# EAGLE design SANE v1 (EAGLE 7.3.0)
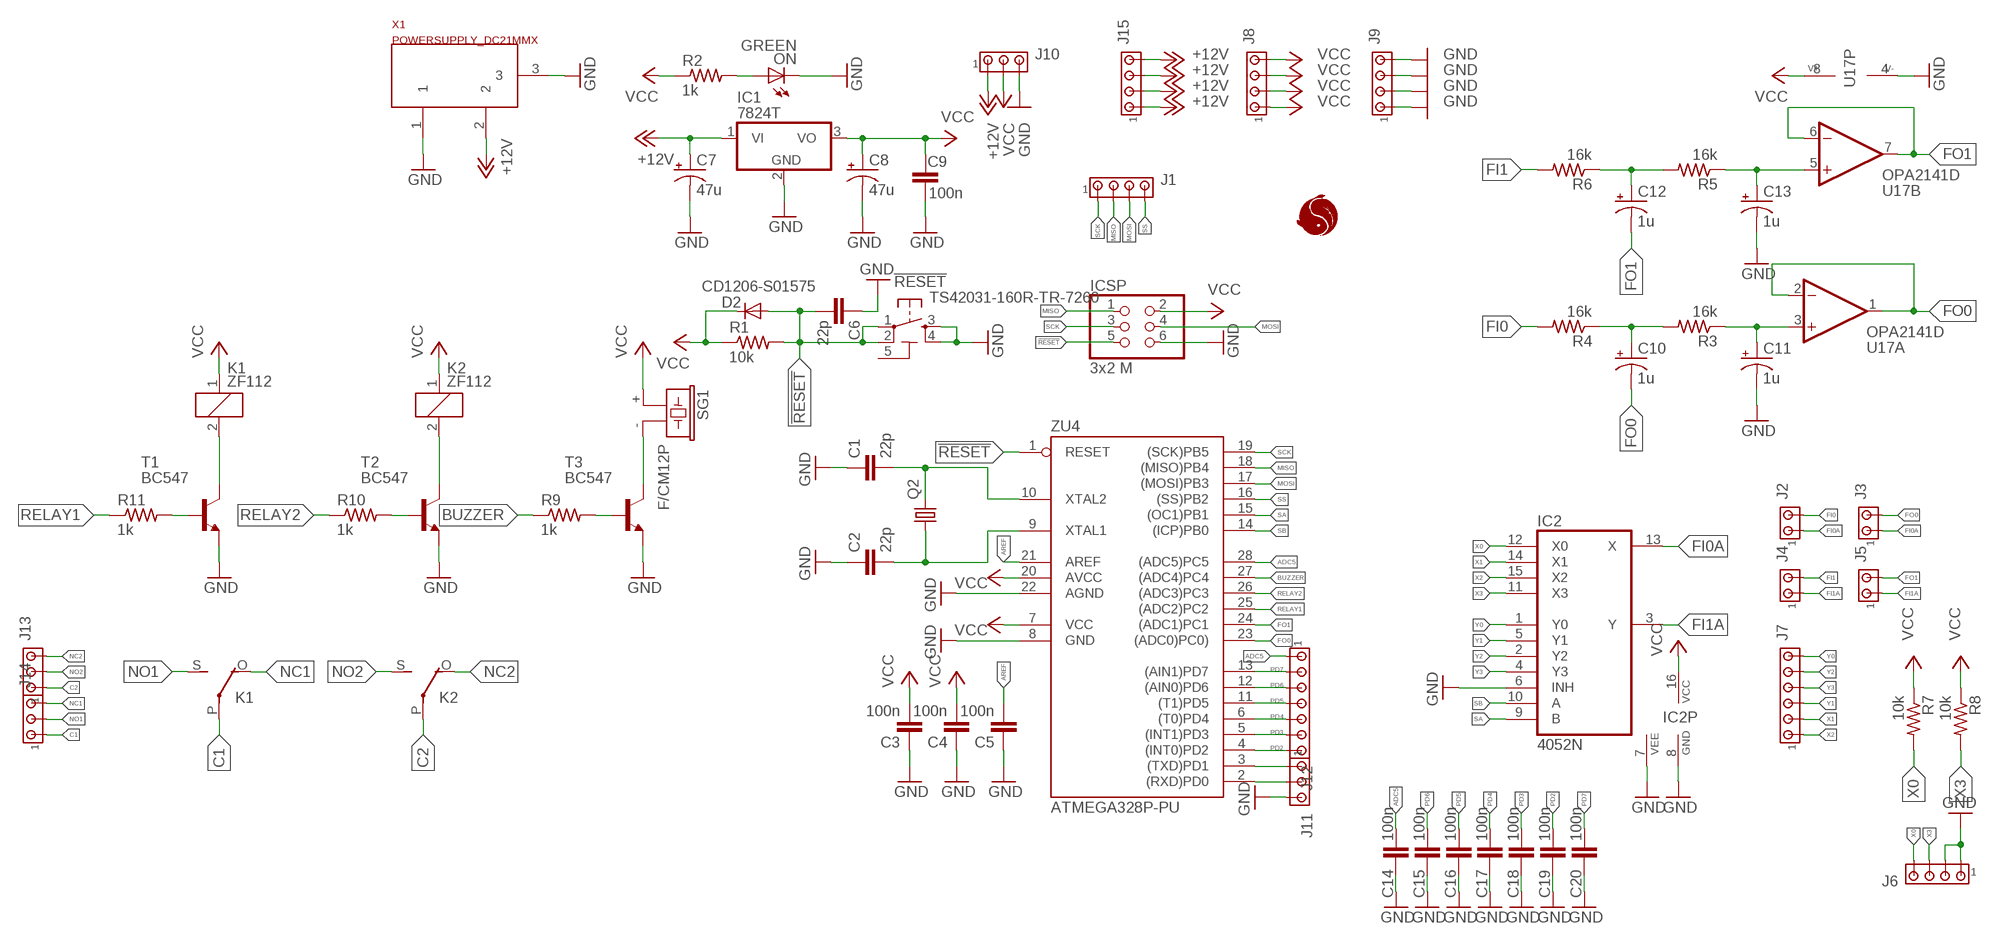
[diagram p0: schematic, sheet 1]

## Parts
!RESET  TS42031-160R-TR-7260  TS42  [TS42]
C1  22p  C-EUC0805  [C0805]
C2  22p  C-EUC0805  [C0805]
C3  100n  C-EUC0805  [C0805]
C4  100n  C-EUC0805  [C0805]
C5  100n  C-EUC0805  [C0805]
C6  22p  C-EUC0805  [C0805]
C7  47u  CPOL-USE2-4  [E2-4]
C8  47u  CPOL-USE2-4  [E2-4]
C9  100n  C-EUC0805  [C0805]
C10  1u  CPOL-USE2-4  [E2-4]
C11  1u  CPOL-USE2-4  [E2-4]
C12  1u  CPOL-USE2-4  [E2-4]
C13  1u  CPOL-USE2-4  [E2-4]
C14  100n  C-EUC0805  [C0805]
C15  100n  C-EUC0805  [C0805]
C16  100n  C-EUC0805  [C0805]
C17  100n  C-EUC0805  [C0805]
C18  100n  C-EUC0805  [C0805]
C19  100n  C-EUC0805  [C0805]
C20  100n  C-EUC0805  [C0805]
D2  CD1206-S01575  DIODE-MINIMELF  [MINIMELF]
IC1  7824T  [TO220H]
IC2  4052N  [DIL16]
ICSP  3x2 M  PINHD-2X3  [2X03]
J1  MTA04-100  [10X04MTA]
J2  MTA02-100  [10X02MTA]
J3  MTA02-100  [10X02MTA]
J4  MTA02-100  [10X02MTA]
J5  MTA02-100  [10X02MTA]
J6  MTA04-100  [10X04MTA]
J7  MTA06-100  [10X06MTA]
J8  MTA04-100  [10X04MTA]
J9  MTA04-100  [10X04MTA]
J10  MTA03-100  [10X03MTA]
J11  MTA03-100  [10X03MTA]
J12  MTA07-100  [10X07MTA]
J13  MTA03-156  [1X3MTA]
J14  MTA03-156  [1X3MTA]
J15  MTA04-100  [10X04MTA]
K1  ZF112  [ZF112]
K2  ZF112  [ZF112]
ON  GREEN  LEDCHIP-LED0805  [CHIP-LED0805]
Q2  CRYSTALHC49U-V  [HC49U-V]
R1  10k  R-US_R0805  [R0805]
R2  1k  R-US_R0805  [R0805]
R3  16k  R-US_R0805  [R0805]
R4  16k  R-US_R0805  [R0805]
R5  16k  R-US_R0805  [R0805]
R6  16k  R-US_R0805  [R0805]
R7  10k  R-US_R0805  [R0805]
R8  10k  R-US_R0805  [R0805]
R9  1k  R-US_R0805  [R0805]
R10  1k  R-US_R0805  [R0805]
R11  1k  R-US_R0805  [R0805]
SG1  F/CM12P  [F/CM12P]
T1  BC547  [TO92]
T2  BC547  [TO92]
T3  BC547  [TO92]
U17  OPA2141D  [SO08]
U$1  LOGO-SANE  [LOGO-SANE]
X1  POWERSUPPLY_DC21MMX  [POWERSUPPLY_DC-21MM]
ZU4  ATMEGA328P-PU  [DIL28-3]

## Nets
!RESET: !RESET.1 !RESET.2 C6.2 D2.A ICSP.5 R1.2 ZU4.1(RESET)
+12V: C7.+ IC1.1(VI) J10.1 J15.1 J15.2 J15.3 J15.4 X1.2
ADC5: C14.2 J12.1 ZU4.28((ADC5)PC5)
AREF: C5.2 ZU4.21(AREF)
BUZZER: R9.1 ZU4.27((ADC4)PC4)
C1: J14.1 K1.P(2:P)
C2: J13.1 K2.P(2:P)
FI0: J2.2 R4.2
FI0A: IC2.13(X) J2.1 J3.1
FI1: J4.2 R6.2
FI1A: IC2.3(Y) J4.1 J5.1
FO0: C10.- J3.2 U17.1(A:OUT) U17.2(A:-IN) ZU4.23((ADC0)PC0))
FO1: C12.- J5.2 U17.6(B:-IN) U17.7(B:OUT) ZU4.24((ADC1)PC1)
GND: !RESET.3 !RESET.4 C1.1 C2.1 C3.1 C4.1 C5.1 C6.1 C7.- C8.- C9.1 C11.- C13.- C14.1 C15.1 C16.1 C17.1 C18.1 C19.1 C20.1 IC1.2(GND) IC2.6(INH) IC2.7(VEE) IC2.8(GND) ICSP.6 J6.1 J6.2 J9.1 J9.2 J9.3 J9.4 J10.3 J11.3 ON.C T1.1(E) T2.1(E) T3.1(E) U17.4(P:V-) X1.1 X1.3 ZU4.8(GND) ZU4.22(AGND)
MISO: ICSP.1 J1.2 ZU4.18((MISO)PB4)
MOSI: ICSP.4 J1.3 ZU4.17((MOSI)PB3)
N$1: C1.2 Q2.2 ZU4.10(XTAL2)
N$2: C2.2 Q2.1 ZU4.9(XTAL1)
N$3: ON.A R2.2
N$4: C11.+ R3.1 U17.3(A:+IN)
N$5: C10.+ R3.2 R4.1
N$6: C12.+ R5.2 R6.1
N$7: C13.+ R5.1 U17.5(B:+IN)
N$8: J11.1 ZU4.3((TXD)PD1)
N$9: J11.2 ZU4.2((RXD)PD0)
N$10: SG1.- T3.3(C)
N$14: K1.2 T1.3(C)
N$15: K2.2 T2.3(C)
N$16: R11.2 T1.2(B)
N$17: R10.2 T2.2(B)
N$18: R9.2 T3.2(B)
NC1: J14.3 K1.O(2:O)
NC2: J13.3 K2.O(2:O)
NO1: J14.2 K1.S(2:S)
NO2: J13.2 K2.S(2:S)
PD2: C19.2 J12.7 ZU4.4((INT0)PD2)
PD3: C18.2 J12.6 ZU4.5((INT1)PD3)
PD4: C17.2 J12.5 ZU4.6((T0)PD4)
PD5: C16.2 J12.4 ZU4.11((T1)PD5)
PD6: C15.2 J12.3 ZU4.12((AIN0)PD6)
PD7: C20.2 J12.2 ZU4.13((AIN1)PD7)
RELAY1: R11.1 ZU4.25((ADC2)PC2)
RELAY2: R10.1 ZU4.26((ADC3)PC3)
SA: IC2.9(B) ZU4.15((OC1)PB1)
SB: IC2.10(A) ZU4.14((ICP)PB0)
SCK: ICSP.3 J1.1 ZU4.19((SCK)PB5)
SS: J1.4 ZU4.16((SS)PB2)
VCC: C3.2 C4.2 C8.+ C9.2 D2.C IC1.3(VO) IC2.16(VCC) ICSP.2 J8.1 J8.2 J8.3 J8.4 J10.2 K1.1 K2.1 R1.1 R2.1 R7.1 R8.1 SG1.+ U17.8(P:V+) ZU4.7(VCC) ZU4.20(AVCC)
X0: IC2.12(X0) J6.4 R7.2
X1: IC2.14(X1) J7.2
X2: IC2.15(X2) J7.1
X3: IC2.11(X3) J6.3 R8.2
Y0: IC2.1(Y0) J7.6
Y1: IC2.5(Y1) J7.3
Y2: IC2.2(Y2) J7.5
Y3: IC2.4(Y3) J7.4

## Power pins joined to a net without a drawn wire
5-GND: !RESET.5(5-GND)

## Library data of the parts
!RESET = SmartPrj:TS42: TS42 Dongnan Electronics Tact switch VDC 12V - 50mA
C1-C6 C9 C14-C20 = rcl:C-EU: CAPACITOR, European symbol
C7 C8 C10-C13 = rcl:CPOL-US: POLARIZED CAPACITOR, American symbol
D2 = diode:DIODE-: DIODE
IC1 = linear:78*: Positive VOLTAGE REGULATOR Source: http://cache.national.com/ds/LM/LM78L05.pdf http://www.fairchildsemi.com/ds/LM/LM7805.pdf
IC2 = 40xx:4052: Dual 4-channel ANALOG MULTIPLEXER
ICSP = SmartPrj:PINHD-2X3: PIN HEADER
J1 J6 J8 J9 J15 = con-amp:MTA04-100: AMP connector
J2-J5 = con-amp:MTA02-100: AMP connector
J7 = con-amp:MTA06-100: AMP connector Connection corrected 2014-09-19
J10 J11 = con-amp:MTA03-100: AMP connector
J12 = con-amp:MTA07-100: AMP connector
J13 J14 = con-amp:MTA03-156: AMP connector
K1 K2 = relay:ZF112: RELAY 1 x switch; OC_FARNELL: unknown; OC_NEWARK: unknown
ON = led:LED: LED OSRAM: - CHIPLED LG R971, LG N971, LY N971, LG Q971, LY Q971, LO R971, LY R971 LH N974, LH R974 LS Q976, LO Q976, LY Q976 LO Q996 - Hyper CHIPLED LW Q18S LB Q993, LB Q99A, LB R99A - SideLED LS A670, LO A670, LY A670, LG A670, LP A670 LB A673, LV A673, LT A673, LW A673 LH A674 LY A675 LS A676, LA A676, LO A676, LY A676, LW A676 LS A679, LY A679, LG A679 - Hyper Micro SIDELED® LS Y876, LA Y876, LO Y876, LY Y876 LT Y87S - SmartLED LW L88C, LW L88S LB L89C, LB L89S, LG L890 LS L89K, LO L89K, LY L89K LS L896, LA L896, LO L896, LY L896 - TOPLED LS T670, LO T670, LY T670, LG T670, LP T670 LSG T670, LSP T670, LSY T670, LOP T670, LYG T670 LG T671, LOG T671, LSG T671 LB T673, LV T673, LT T673, LW T673 LH T674 LS T676, LA T676, LO T676, LY T676, LB T676, LH T676, LSB T676, LW T676 LB T67C, LV T67C, LT T67C, LS T67K, LO T67K, LY T67K, LW E67C LS E67B, LA E67B, LO E67B, LY E67B, LB E67C, LV E67C, LT E67C LW T67C LS T679, LY T679, LG T679 LS T770, LO T770, LY T770, LG T770, LP T770 LB T773, LV T773, LT T773, LW T773 LH T774 LS E675, LA E675, LY E675, LS T675 LS T776, LA T776, LO T776, LY T776, LB T776 LHGB T686 LT T68C, LB T68C - Hyper Mini TOPLED® LB M676 - Mini TOPLED Santana® LG M470 LS M47K, LO M47K, LY M47K Source: http://www.osram.convergy.de LUXEON: - LUMILED® LXK2-PW12-R00, LXK2-PW12-S00, LXK2-PW14-U00, LXK2-PW14-V00 LXK2-PM12-R00, LXK2-PM12-S00, LXK2-PM14-U00 LXK2-PE12-Q00, LXK2-PE12-R00, LXK2-PE12-S00, LXK2-PE14-T00, LXK2-PE14-U00 LXK2-PB12-K00, LXK2-PB12-L00, LXK2-PB12-M00, LXK2-PB14-N00, LXK2-PB14-P00, LXK2-PB14-Q00 LXK2-PR12-L00, LXK2-PR12-M00, LXK2-PR14-Q00, LXK2-PR14-R00 LXK2-PD12-Q00, LXK2-PD12-R00, LXK2-PD12-S00 LXK2-PH12-R00, LXK2-PH12-S00 LXK2-PL12-P00, LXK2-PL12-Q00, LXK2-PL12-R00 Source: www.luxeon.com KINGBRIGHT: KA-3528ASYC Source: www.kingbright.com
Q2 = crystal:CRYSTAL: CRYSTAL; OC_FARNELL: 1666969; OC_NEWARK: unknown
R1-R11 = resistor:R-US_: RESISTOR, American symbol
SG1 = buzzer:F/CM12P: BUZZER Source: Buerklin; OC_FARNELL: unknown; OC_NEWARK: unknown
T1-T3 = transistor:BC547: NPN TRANSISTOR
U17 = amp-op:OPA2141: OP-AMP Single-Supply, 10MHz, Rail-to-Rail Output, Low-Noise, JFET Amplifier
U$1 = logo-sane:LOGO-SANE
X1 = SmartPrj:POWERSUPPLY_DC21MM
ZU4 = SmartPrj:ATMEGA328P-: MICROCONTROLLER 4 Kbytes FLASH 128 bytes SRAM 256 bytes EEPROM UART 6-channel 10 bit ADC

## Net classes
0 default: width 0.203 mm, drill 0.406 mm, clearance 0.203 mm
1 power: width 0.61 mm, drill 0.61 mm, clearance 0.254 mm
2 gnd: width 0.305 mm, drill 0.559 mm, clearance 0.254 mm
3 usbvcc: width 0.508 mm, drill 0.61 mm, clearance 0.254 mm

## Board
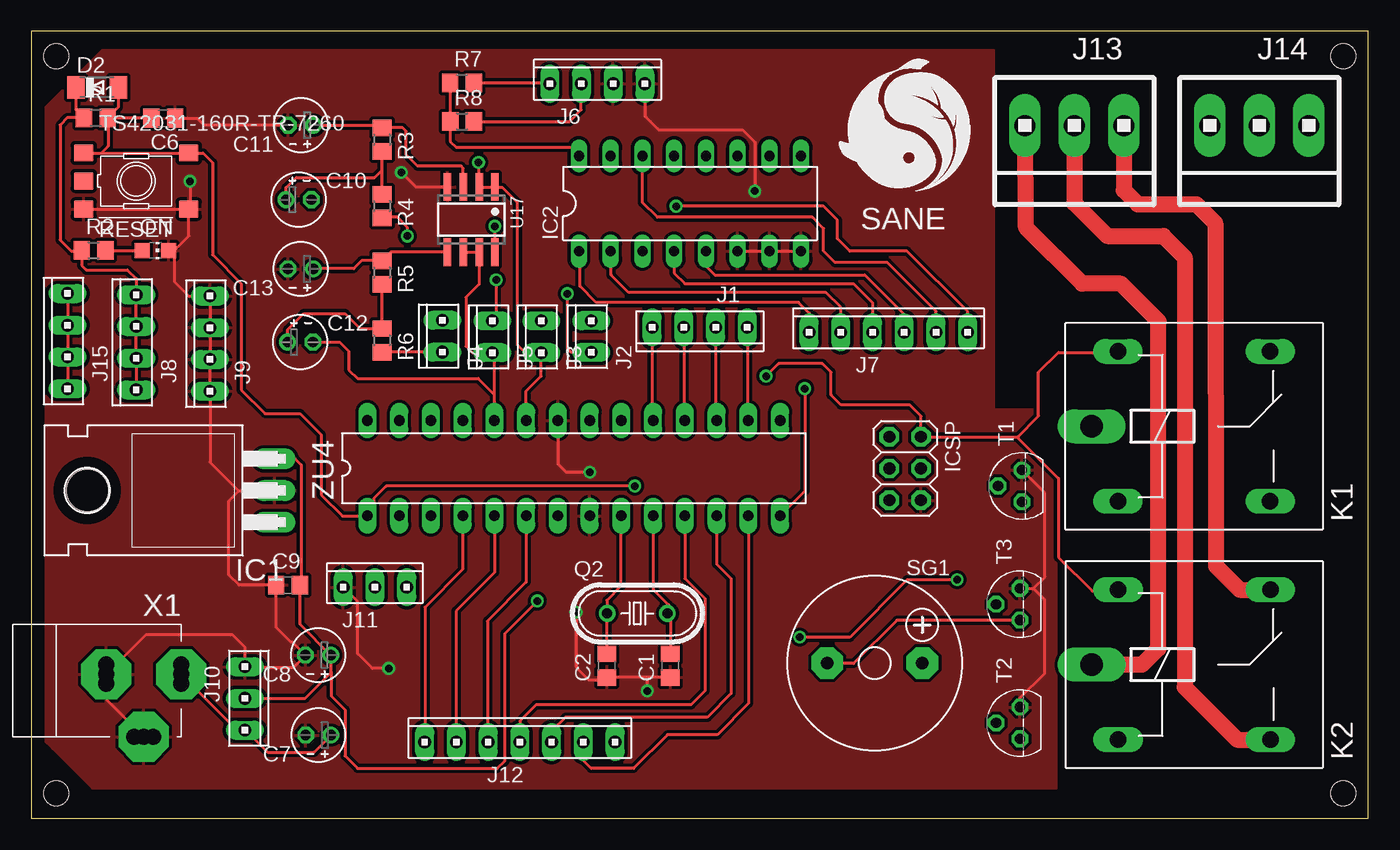
[diagram p1: board, top side]
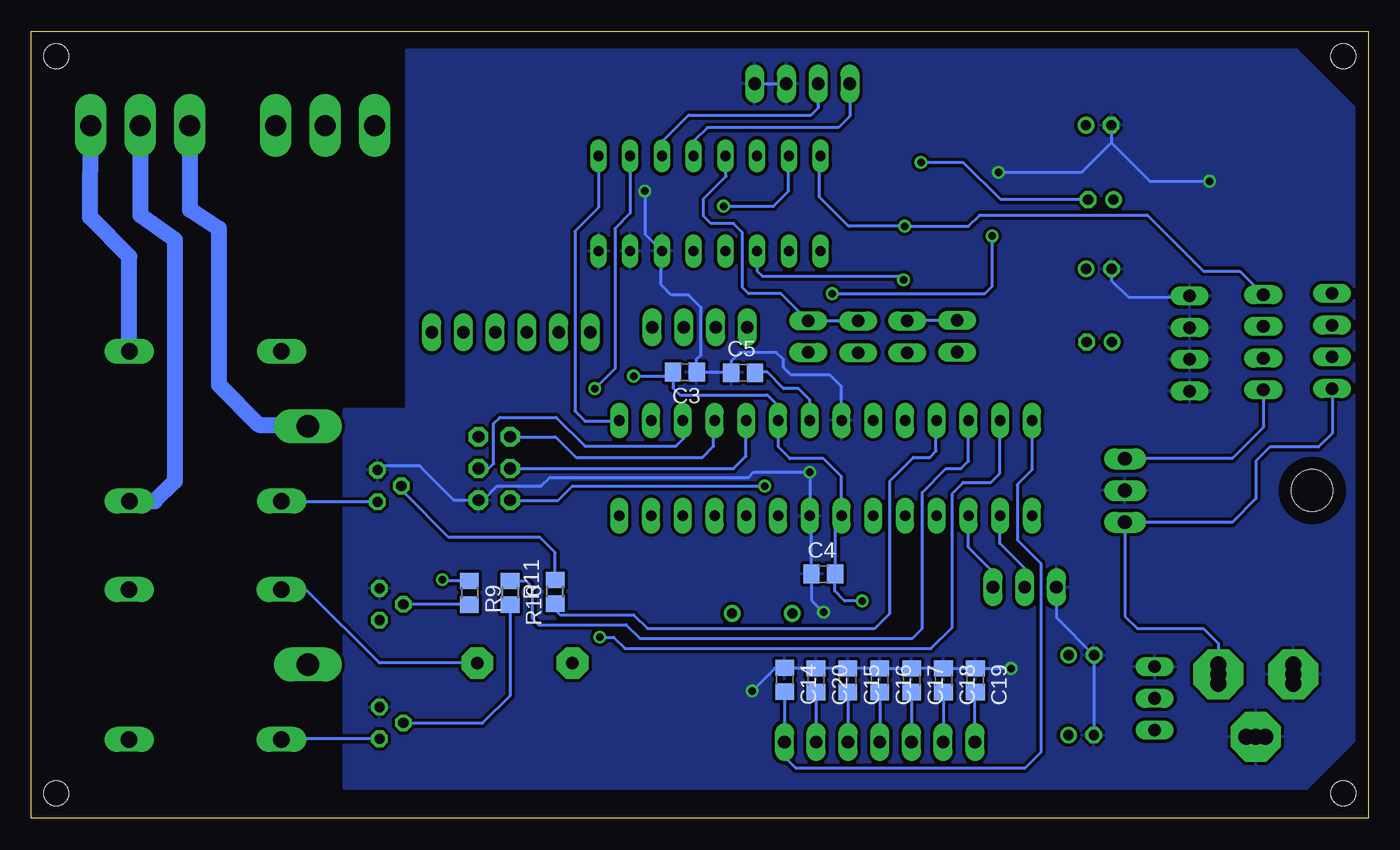
[diagram p2: board, bottom side, seen from below]

Size 107 x 63 mm. Coordinates in mm from the lower left corner, seen from the top.
Outline: 0,0 107,0 107,63 0,63 0,0
Copper layers (1*16): Top 0.035mm / dielectric 1.5mm / Bottom 0.035mm
Design rules "default *": minimum track width 10mil, minimum drill 24mil, track to track 10mil, track to pad 10mil, pad to pad 10mil, via to via 10mil, smd to smd 10mil, copper to edge 40mil, drill to drill 8mil, minimum pad ring 10mil, minimum via ring 8mil, stop-mask expansion 4mil, vias tented up to drill 0mil, thermal gap 10mil
Holes 2 mm at 105,2 105,61 2,61 2,2

### Footprints (pad centres in the part's own frame; a part is rotated, then mirrored left to right if it is on the bottom)
TS42 = smd 1.6 x 1.4: 1 -4.2,2.25; 2 4.2,2.25; 3 -4.2,-2.25; 4 4.2,-2.25; 5 -4.2,0
C0805 = smd 1.3 x 1.5: 1 -0.95,0; 2 0.95,0
E2-4 = drill 0.813 pad 1.27: + -1.016,0 | drill 0.813 pad 1.27 octagon: - 1.016,0
MINIMELF = smd 1.4 x 1.8: A 1.7,0; C -1.7,0
TO220H = drill 1.118 long: 1 -2.54,-10.16; 2 0,-10.16; 3 2.54,-10.16 | hole 3.302: 0,4.826
DIL16 = drill 0.813 long: 1 -8.89,-3.81; 2 -6.35,-3.81; 3 -3.81,-3.81; 4 -1.27,-3.81; 5 1.27,-3.81; 6 3.81,-3.81; 7 6.35,-3.81; 8 8.89,-3.81; 9 8.89,3.81; 10 6.35,3.81; 11 3.81,3.81; 12 1.27,3.81; 13 -1.27,3.81; 14 -3.81,3.81; 15 -6.35,3.81; 16 -8.89,3.81
2X03 = drill 0.95 pad 1.55 octagon: 1 -2.54,-1.27; 2 -2.54,1.27; 3 0,-1.27; 4 0,1.27; 5 2.54,-1.27; 6 2.54,1.27
10X04MTA = drill 1.016 long: 1 3.81,0; 2 1.27,0; 3 -1.27,0; 4 -3.81,0
10X02MTA = drill 1.016 long: 1 1.27,0; 2 -1.27,0
10X06MTA = drill 1.016 long: 1 6.35,0; 2 3.81,0; 3 1.27,0; 4 -1.27,0; 5 -3.81,0; 6 -6.35,0
10X03MTA = drill 1.016 long: 1 2.54,0; 2 0,0; 3 -2.54,0
10X07MTA = drill 1.016 long: 1 7.62,0; 2 5.08,0; 3 2.54,0; 4 0,0; 5 -2.54,0; 6 -5.08,0; 7 -7.62,0
1X3MTA = drill 1.676 long: 1 3.937,0; 2 -0.025,0; 3 -3.988,0
ZF112 = drill 1.321 long: 1 -6.096,5.994; 2 -6.096,-5.994; O 6.096,5.994; S 6.096,-5.994 | drill 1.803 long: P -8.204,0
CHIP-LED0805 = smd 1.2 x 1.2: A 0,-1.05; C 0,1.05
HC49U-V = drill 0.813: 1 -2.413,0; 2 2.413,0
R0805 = smd 1.3 x 1.5: 1 -0.95,0; 2 0.95,0
F/CM12P = drill 1.016 pad 2.54 octagon: + 3.81,0; - -3.81,0
TO92 = drill 0.813 octagon: 1 1.27,0; 2 0,1.905; 3 -1.27,0
SO08 = smd 0.6 x 2.2: 1 -1.905,-2.6; 2 -0.635,-2.6; 3 0.635,-2.6; 4 1.905,-2.6; 5 1.905,2.6; 6 0.635,2.6; 7 -0.635,2.6; 8 -1.905,2.6
POWERSUPPLY_DC-21MM = drill 1.3 pad 4 octagon: 1 -5.08,-3.353; 2 -0.076,-6.35; 3 -0.076,-0.356 | drill 1.3: 4 -5.08,-4.115; 5 -5.08,-2.591; 6 -0.838,-0.356; 7 0.686,-0.356; 8 -0.838,-6.35; 9 0.686,-6.35
DIL28-3 = drill 0.85 pad 1.422 long: 1 -16.51,-3.81; 2 -13.97,-3.81; 3 -11.43,-3.81; 4 -8.89,-3.81; 5 -6.35,-3.81; 6 -3.81,-3.81; 7 -1.27,-3.81; 8 1.27,-3.81; 9 3.81,-3.81; 10 6.35,-3.81; 11 8.89,-3.81; 12 11.43,-3.81; 13 13.97,-3.81; 14 16.51,-3.81; 15 16.51,3.81; 16 13.97,3.81; 17 11.43,3.81; 18 8.89,3.81; 19 6.35,3.81; 20 3.81,3.81; 21 1.27,3.81; 22 -1.27,3.81; 23 -3.81,3.81; 24 -6.35,3.81; 25 -8.89,3.81; 26 -11.43,3.81; 27 -13.97,3.81; 28 -16.51,3.81

### Placement (x,y rotation side)
!RESET  8.4,51.01 0 top
C1  51.14,12.22 90 top
C2  46.06,12.22 90 top
C3  54.7,35.72 180 bottom
C4  43.6,19.56 0 bottom
C5  50.03,35.67 0 bottom
C6  10.56,56.03 180 top
C7  22.98,6.66 180 top
C8  22.96,13.06 180 top
C9  20.54,18.67 0 top
C10  21.41,49.52 0 top
C11  21.58,55.48 180 top
C12  21.53,38.12 0 top
C13  21.56,43.98 180 top
C14  46.71,11.09 270 bottom
C15  41.65,11.06 270 bottom
C16  39.1,11.06 270 bottom
C17  36.55,11.06 270 bottom
C18  34,11.06 270 bottom
C19  31.45,11.06 270 bottom
C20  44.2,11.06 270 bottom
D2  5.26,58.51 0 top
IC1  9.31,26.24 90 top
IC2  52.72,49.21 0 top
ICSP  69.94,28 270 top
J1  53.5,39.3 180 top
J2  44.81,38.56 90 top
J3  40.81,38.54 90 top
J4  32.91,38.59 90 top
J5  36.91,38.54 90 top
J6  45.3,58.8 0 top
J7  68.6,38.9 0 top
J8  8.4,38.1 90 top
J9  14.3,38 90 top
J10  17.1,9.6 270 top
J11  27.5,18.5 0 top
J12  39.1,6.1 0 top
J13  83.45,55.45 180 top
J14  98.25,55.45 180 top
J15  2.9,38.2 90 top
K1  93.06,31.38 0 top
K2  93.07,12.31 0 top
ON  9.94,45.45 270 top
Q2  48.5,16.4 0 top
R1  5.16,56.07 0 top
R2  4.99,45.46 0 top
R3  28.07,54.32 270 top
R4  28.07,49 270 top
R5  28.07,43.68 270 top
R6  28.07,38.26 270 top
R7  34.46,58.87 0 top
R8  34.48,55.77 0 top
R9  71.93,18.06 270 bottom
R10  68.68,18.06 270 bottom
R11  65.07,18.14 90 bottom
SG1  67.5,12.43 0 top
T1  79.29,26.6 90 top
T2  79.13,7.63 90 top
T3  79.13,17.13 90 top
U17  35.21,47.92 180 top
U$1  65.2,49.9 0 top
X1  5.65,11.61 90 top
ZU4  43.42,28.03 0 top

### Tracks (layer width: path | path; a pad name or v marks a point on that pad's centre or on a via)
!RESET  (via drill 0.6)
  Top 0.254: !RESET.1 5.6,53.26 | 5.6,53.26 !RESET.2 13.74,53.26 14.5,52.5 14.5,45.1 16.8,42.8 16.8,34.3 18.7,32.4 21.5,32.4 23.2,30.7 23.2,25.9 24.9,24.2 26.89,24.2 ZU4.1 27.4,24.71 27.4,25.6 28.4,26.6 v48.3,26.6 | C6.2 6.15,56.03 | 6.15,56.03 R1.2 6.96,56.92 D2.A | 6.15,56.03 6.15,53.81 5.6,53.26
  Bottom 0.254: ICSP.5 64.84,25.46 63.7,26.6 v48.3,26.6
+12V
  Top 0.254: X1.2 16.47,7.06 J10.1 17.5,6.66 17.54,6.66 18.9,5.3 22.64,5.3 C7.+ | J15.1 J15.2 J15.3 J15.4
  Bottom 0.254: X1.2 12,14 13.2,15.2 18.5,15.2 19.47,16.17 IC1.1 10.9,23.7 9,25.6 9,28.6 7.9,29.7 4,29.7 2.9,30.8 J15.4
ADC5
  Bottom 0.254: C14.2 J12.1 46.7,6.08 46.7,4.9 45.8,4 27.5,4 26.2,5.3 26.2,20.4 28.1,22.3 28.1,26.7 26.91,27.89 ZU4.28
AREF
  Bottom 0.254: ZU4.21 44.69,33.49 45.6,34.4 46.8,34.4 48.1,35.7 49.05,35.7 C5.2
BUZZER  (via drill 0.6)
  Top 0.254: v74.1,19.1 70.1,19.1 65.5,14.5 v61.5,14.5
  Bottom 0.254: R9.1 74.01,19.01 v74.1,19.1 | v61.5,14.5 60.4,14.5 59.5,13.6 35,13.6 33.3,15.3 33.3,26 32.4,26.9 30.2,26.9 29.5,27.6 29.5,31.79 ZU4.27
C1
  Bottom 1.27: J14.1 94.31,48.71 92,47.2 92,34.7 88.8,31.5 84.98,31.5 K1.P
C2
  Top 1.27: K2.P 88.91,12.31 90.2,13.6 90.2,39.8 87.2,42.8 84.1,42.8 79.6,47.3 79.55,55.41 J13.1
FI0  (via drill 0.6)
  Top 0.254: J2.2 43.21,37.29 42.9,37.6 v42.9,42 | v30.1,46.6 30.1,47.3 29.3,48.1 28.12,48.1 R4.2
  Bottom 0.254: v42.9,42 30.7,42 30.1,42.6 v30.1,46.6
FI0A
  Bottom 0.254: J3.1 44.79,39.81 J2.1 44.83,39.83 47,42 49.6,42 50.1,42.5 50.1,46.9 50.8,47.6 52.6,47.6 53.2,48.2 53.2,49.6 51.4,51.4 51.4,52.97 IC2.13
FI1
  Top 0.254: J4.2 R6.2
FI1A  (via drill 0.6)
  Top 0.254: v37.2,43.1 37.2,40.1 J5.1
  Bottom 0.254: J4.1 36.86,39.86 J5.1 | IC2.3 48.91,43.81 48.5,43.4 37.5,43.4 v37.2,43.1
FO0  (via drill 0.6)
  Top 0.254: ZU4.23 39.61,34.21 40.8,35.4 J3.2 39.53,37.27 38.9,37.9 38.9,49.3 37.7,50.5 37.13,50.5 U17.1 U17.2 35.8,50.56 v35.8,52.5
  Bottom 0.254: C10.- 29.42,49.52 32.4,52.5 v35.8,52.5
FO1
  Top 0.254: ZU4.24 37.07,33.9 | 37.07,33.9 37.07,37.11 J5.2 36.88,37.3 35.3,37.3 34.8,37.8 34.8,41.7 35.84,42.74 U17.7 U17.6 | C12.- 24.68,38.12 25.4,37.4 25.4,35.9 26.1,35.2 35.77,35.2 37.07,33.9
GND  (via drill 0.6)
  Top 0.254: X1.1 6.01,9.53 X1.3 9.17,14.7 16.1,14.7 17.1,13.7 J10.3 17.1,12.1 20.98,12.1 C8.- 20.9,14.1 20.8,14.1 19.6,15.3 C9.1 16.63,18.67 15.8,19.5 15.8,25.4 16.6,26.2 | 16.6,26.2 19.43,26.2 IC1.2 | 16.6,26.2 14.3,28.5 J9.4 J9.3 J9.2 J9.1 12.6,41.8 11.45,42.95 11.45,45.45 | C1.1 49.3,11.27 | 49.3,11.27 C2.1 45.89,11.1 44.6,11.1 43.6,12.1 v43.6,16.5 | ON.C 11.45,45.45 | 11.45,45.45 12.6,46.6 !RESET.4 | !RESET.3 !RESET.4 | C11.- 13.82,55.48 13.3,56 11.54,56 C6.1 | IC2.6 IC2.7 IC2.8 | T2.1 79.13,9.63 81.1,11.6 81.1,17.5 80.2,18.4 | T3.1 80.2,18.4 | 80.2,18.4 81.1,19.3 81.1,26.06 T1.1 | v12.7,51 12.7,48.86 !RESET.4 | U17.4 30.78,50.52 v29.6,51.7 | J6.1 49.11,56.19 50.2,55.1 56.9,55.1 57.9,54.1 v57.9,50.2 | v49.3,10.2 49.3,11.27 | v28.6,12 27.3,12 26.1,13.2 26.1,17.36 J11.3 | ZU4.22 42.15,28.35 42.8,27.7 v44.7,27.7
  Bottom 0.254: C7.- 21.94,6.68 C8.- 24.96,16.08 J11.3 | 46.68,12.01 C20.1 C15.1 C16.1 C17.1 C18.1 C19.1 v28.61,12.01 v28.6,12 | 46.68,12.01 C14.1 | C13.- 20.54,43.04 19.2,41.7 14.41,41.7 J9.1 | J6.1 J6.2 | T1.1 78.96,28.2 75.9,28.2 73.16,25.46 ICSP.6 70.84,25.46 69.7,26.6 66.2,26.6 65.5,27.3 49.6,27.3 49.2,27.7 v44.7,27.7 ZU4.8 44.55,24.08 C4.1 44.55,17.45 v43.6,16.5 | C11.- 20.56,54.06 | 20.56,54.06 17.5,51 v12.7,51 | v29.6,51.7 22.93,51.7 20.56,54.06 | ZU4.22 42.15,34.55 43.1,35.5 46.2,35.5 46.8,36.1 46.8,36.7 47.4,37.3 50.3,37.3 50.98,36.62 C5.1 53.7,35.67 C3.1 53.75,36.75 53.4,37.1 53.4,40.9 54.4,41.9 55.8,41.9 56.6,42.7 56.6,45.33 IC2.6 57.9,46.77 v57.9,50.2 | 46.68,12.01 47.49,12.01 v49.3,10.2
  pour Bottom: 0.6,56.4 5.7,61.5 77,61.5 77,32.7 82,32.7 82,2.4 4.9,2.4 0.7,6.6 0.7,56.3
  pour Top: 0.6,56.5 0.7,56.5 5.7,61.5 77,61.5 77,32.7 82,32.7 82,2.4 4.9,2.4 1.7,5.6 1,6.3 0.7,6.6 0.7,56.4
MISO
  Top 0.254: J1.2 52.23,31.92 ZU4.18
  Bottom 0.254: ICSP.1 65.04,30.54 63.4,28.9 53.3,28.9 52.4,29.8 52.4,31.75 ZU4.18
MOSI
  Top 0.254: J1.3 54.77,31.92 ZU4.17
  Bottom 0.254: ICSP.4 70.4,28 70,28.4 70,31.6 69.5,32.1 65,32.1 62.7,29.8 55.4,29.8 54.8,30.4 54.8,31.79 ZU4.17
N$1
  Top 0.254: ZU4.10 49.8,24.19 49.8,18.3 51,17.1 50.91,17.1 Q2.2 51.14,16.4 C1.2 50.91,13.4
N$2
  Top 0.254: ZU4.9 47.2,24.19 47.2,18.6 46.06,17.46 46.09,17.46 Q2.1 46.09,13.2 C2.2
N$3
  Top 0.254: R2.2 ON.A
N$4
  Top 0.254: C11.+ 27.86,55.48 R3.1 28.1,55.3 29.7,55.3 30,55 30,53.1 30.9,52.2 34.4,52.2 34.58,52.02 U17.3
N$5
  Top 0.254: R4.1 28.07,51.9 | 28.07,51.9 R3.2 | C10.+ 20.39,50.49 21.2,51.3 27.47,51.3 28.07,51.9
N$6
  Top 0.254: R5.2 R6.1 26.3,39.2 25.1,40.4 21.8,40.4 20.51,39.11 C12.+
N$7
  Top 0.254: U17.5 28.76,45.32 R5.1 26.43,44.63 25.8,44 22.6,44 C13.+
N$8
  Bottom 0.254: J11.1 30.04,19.74 32,21.7 ZU4.3
N$9
  Bottom 0.254: J11.2 27.5,20 29.5,22 29.5,24.17 ZU4.2
N$10
  Top 0.254: T3.3 69.26,15.86 65.8,12.4 63.72,12.4 SG1.-
N$14
  Bottom 0.254: T1.3 86.91,25.33 K1.2
N$15
  Bottom 0.254: T2.3 86.93,6.36 K2.2
N$16
  Bottom 0.254: R11.2 65.07,21.27 66.3,22.5 73.6,22.5 77.1,26 77.1,26.32 T1.2
N$17
  Bottom 0.254: R10.2 68.68,9.82 70.9,7.6 77.19,7.6 T2.2
N$18
  Bottom 0.254: R9.2 77.2,17.11 T3.2
NC1
  Bottom 1.27: K1.O 99.16,44.96 102.3,48.1 102.25,55.44 J14.3
NC2
  Top 1.27: J13.3 87.44,50.26 88.55,49.15 93.25,49.15 94.75,47.65 94.8,20.2 96.7,18.3 K2.O
NO1
  Bottom 1.27: K1.S 97.11,25.39 95.5,27 95.5,46.3 98.25,48.25 98.25,55.42 J14.2
NO2
  Top 1.27: J13.2 83.47,49.23 86.1,46.6 90.6,46.6 92.3,44.9 92.3,10.5 96.5,6.3 99.15,6.3 K2.S
PD2
  Top 0.254: ZU4.4 34.53,19.93 31.5,16.9 31.5,6.12 J12.7
  Bottom 0.254: J12.7 31.48,10.08 C19.2
PD3
  Top 0.254: ZU4.5 37.07,19.67 34,16.6 34,6.12 J12.6
  Bottom 0.254: C18.2 34,6.12 J12.6
PD4
  Top 0.254: ZU4.6 39.61,18.91 36.5,15.8 36.5,6.16 J12.5
  Bottom 0.254: C17.2 J12.5
PD5
  Top 0.254: ZU4.11 52.31,19.19 53.9,17.6 53.9,10.2 52.8,9.1 40.4,9.1 39.1,7.8 J12.4
  Bottom 0.254: C16.2 J12.4
PD6
  Top 0.254: ZU4.12 54.85,20.35 56,19.2 56,10 54.1,8.1 42.75,8.1 41.65,7 J12.3
  Bottom 0.254: C15.2 J12.3
PD7
  Top 0.254: ZU4.13 57.39,9.19 54.9,6.7 50.9,6.7 48.2,4 44.8,4 44.2,4.6 44.2,6.08 J12.2
  Bottom 0.254: C20.2 44.2,6.12 J12.2
RELAY1
  Bottom 0.254: R11.1 65.07,16.67 64.7,16.3 58.8,16.3 57.7,15.2 39.5,15.2 38.3,16.4 38.3,27 36.4,28.9 35.1,28.9 34.6,29.4 34.6,31.77 ZU4.25
RELAY2
  Bottom 0.254: R10.1 67.41,19.01 66.9,18.5 66.9,16 66.4,15.5 59.4,15.5 58.3,14.4 36.5,14.4 35.7,15.2 35.7,26.1 33.8,28 32.6,28 32,28.6 ZU4.26
SA
  Bottom 0.254: IC2.9 61.61,48.89 63.5,47 63.5,32.6 62.7,31.8 59.97,31.8 ZU4.15
SB  (via drill 0.6)
  Top 0.254: v61.9,34.4 61.9,26.19 ZU4.14
  Bottom 0.254: IC2.10 59.07,48.43 60.3,47.2 60.3,36 v61.9,34.4
SCK
  Top 0.254: J1.1 49.69,31.92 ZU4.19
  Bottom 0.254: ICSP.3 50.8,28 49.8,29 49.8,31.81 ZU4.19
SS
  Top 0.254: J1.4 57.31,31.92 ZU4.16
VCC  (via drill 0.6)
  Top 0.254: J10.2 21.9,9.6 24,11.7 | 24,11.7 24,13.04 C8.+ 21.49,15.55 C9.2 21.6,18.78 21.6,28.3 21.12,28.78 IC1.3 | J8.4 J8.3 J8.2 J8.1 8.4,43.2 7.7,43.9 4.4,43.9 4.04,44.26 R2.1 3.98,45.4 3.2,45.4 2.3,46.3 2.3,55.5 2.87,56.07 R1.1 3.56,56.72 D2.C | R7.1 33.51,55.79 R8.1 33.53,54.17 34,53.7 43.15,53.7 IC2.16 | U17.8 37.12,47.38 v37.1,47.4 | 24,11.7 24,9.8 25.1,8.7 25.1,5 26.1,4 37.3,4 37.9,4.6 37.9,14.8 v40.5,17.4 | 78.94,30.54 ICSP.2 71.21,32.19 70.3,33.1 64.8,33.1 64,33.9 64,35.7 63.3,36.4 59.8,36.4 v58.8,35.4 | 78.94,30.54 80.6,32.2 80.6,35.7 82.2,37.3 86.89,37.3 K1.1 | 78.94,30.54 78.94,30.46 82.2,27.2 82.2,20.9 84.9,18.2 86.87,18.2 K2.1
  Bottom 0.254: J8.4 8.4,31.3 10.9,28.8 19.45,28.8 IC1.3 | 47.3,31.77 ZU4.20 | SG1.+ 79.13,12.43 84.9,18.2 86.87,18.2 K2.1 | IC2.16 43.9,52.95 43.9,49.7 41.6,47.4 v37.1,47.4 32,47.4 31.1,48.3 17.7,48.3 13.2,43.8 10.29,43.8 J8.1 | ZU4.20 47.2,31.87 47.2,33 48.1,33.9 55.1,33.9 55.65,34.45 C3.2 55.97,35.4 v58.8,35.4 | ZU4.20 47.2,31.81 47.2,29.7 46.3,28.8 43.6,28.8 42.15,27.35 ZU4.7 42.65,23.72 C4.2 42.7,19.51 42.7,18.2 41.9,17.4 v40.5,17.4
X0
  Top 0.254: R7.2 41.42,58.87 J6.4
  Bottom 0.254: J6.4 41.49,56.21 42.4,55.3 52.9,55.3 54,54.2 IC2.12
X1
  Top 0.254: J7.2 72.41,40.59 68.5,44.5 64.3,44.5 63.4,45.4 63.4,47.2 62.5,48.1 50.1,48.1 48.9,49.3 IC2.14
X2  (via drill 0.6)
  Top 0.254: J7.1 74.95,40.55 70.1,45.4 65.5,45.4 64.5,46.4 64.5,47.9 63.4,49 v51.6,49
  Bottom 0.254: v51.6,49 47.6,49 46.4,50.2 46.4,52.99 IC2.15
X3
  Top 0.254: R8.2 43.07,55.77 44,56.7 44,58.77 J6.3
  Bottom 0.254: IC2.11 56.53,54.17 54.4,56.3 44.6,56.3 44,56.9 44,58.77 J6.3
Y0
  Top 0.254: J7.6 62.25,40.45 61.4,41.3 45.2,41.3 43.9,42.6 43.9,45.33 IC2.1
Y1
  Top 0.254: IC2.5 53.99,44.21 54.7,43.5 66.7,43.5 69.9,40.3 69.9,38.93 J7.3
Y2
  Top 0.254: J7.5 64.79,40.91 63.6,42.1 47.8,42.1 46.4,43.5 46.4,45.37 IC2.2
Y3
  Top 0.254: IC2.4 51.45,43.65 52.3,42.8 65.8,42.8 67.3,41.3 67.3,38.93 J7.4

### Text on the board
tPlace: SANE